# EAGLE design IMU (EAGLE 9.6.1)
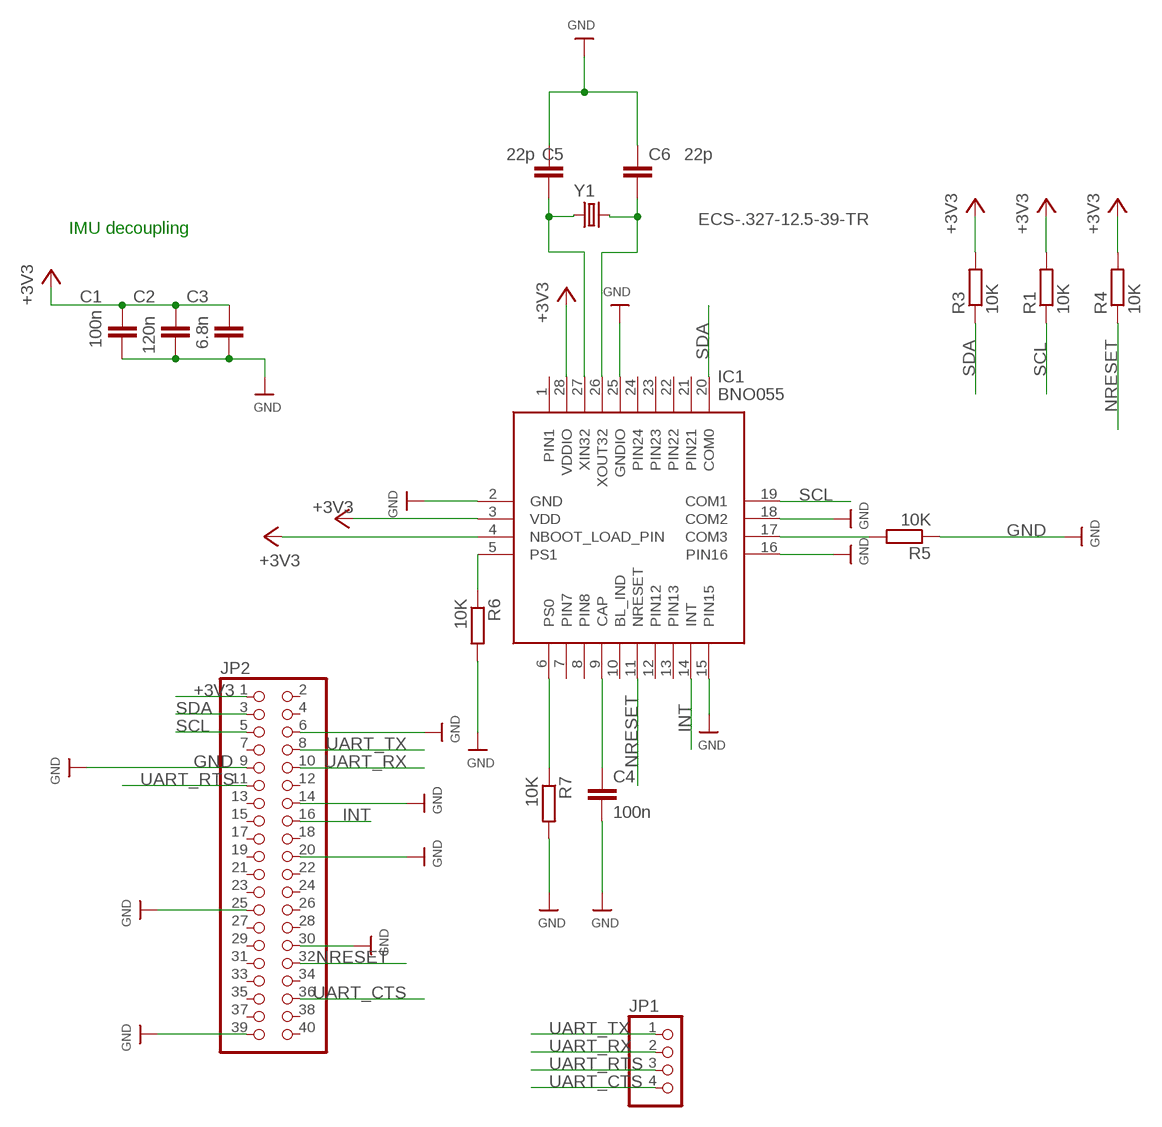
[diagram p0: schematic, sheet 1]

## Parts
C1  100n  C-EUC0805  [C0805]
C2  120n  C-EUC0805  [C0805]
C3  6.8n  C-EUC0805  [C0805]
C4  100n  C-EUC0805  [C0805]
C5  22p  C-EUC0805  [C0805]
C6  22p  C-EUC0805  [C0805]
IC1  BNO055  [BNO055]
JP1  PINHD-1X4  [1X04]
JP2  PINHD-2X20  [2X20]
R1  10K  R-EU_R0805  [R0805]
R3  10K  R-EU_R0805  [R0805]
R4  10K  R-EU_R0805  [R0805]
R5  10K  R-EU_R0805  [R0805]
R6  10K  R-EU_R0805  [R0805]
R7  10K  R-EU_R0805  [R0805]
Y1  ECS-.327-12.5-39-TR  [ECS-.327-12.5-39-TR]

## Nets
+3V3: C1.1 C2.1 C3.1 IC1.3(VDD) IC1.4(NBOOT_LOAD_PIN) IC1.28(VDDIO) JP2.1 R1.2 R3.2 R4.2
ADD_SEL: IC1.17(COM3) R5.2
CAP: C4.1 IC1.9(CAP)
GND: C1.2 C2.2 C3.2 C4.2 C5.1 C6.1 IC1.2(GND) IC1.15(PIN15) IC1.16(PIN16) IC1.18(COM2) IC1.25(GNDIO) JP2.6 JP2.9 JP2.14 JP2.20 JP2.25 JP2.30 JP2.39 R5.1 R6.2 R7.2
INT: IC1.14(INT) JP2.16
NRESET: IC1.11(NRESET) JP2.32 R4.1
PS0: IC1.6(PS0) R7.1
PS1: IC1.5(PS1) R6.1
SCL: IC1.19(COM1) JP2.5 R1.1
SDA: IC1.20(COM0) JP2.3 R3.1
UART_CTS: JP1.4 JP2.36
UART_RTS: JP1.3 JP2.11
UART_RX: JP1.2 JP2.10
UART_TX: JP1.1 JP2.8
XIN: C5.2 IC1.27(XIN32) Y1.1
XOUT: C6.2 IC1.26(XOUT32) Y1.2
Unconnected: IC1.1(PIN1) IC1.7(PIN7) IC1.8(PIN8) IC1.10(BL_IND) IC1.12(PIN12) IC1.13(PIN13) IC1.21(PIN21) IC1.22(PIN22) IC1.23(PIN23) IC1.24(PIN24) JP2.2 JP2.4 JP2.7 JP2.12 JP2.13 JP2.15 JP2.17 JP2.18 JP2.19 JP2.21 JP2.22 JP2.23 JP2.24 JP2.26 JP2.27 JP2.28 JP2.29 JP2.31 JP2.33 JP2.34 JP2.35 JP2.37 JP2.38 JP2.40

## Notes on the sheet
- IMU decoupling

## Library data of the parts
C1-C6 = rcl:C-EU: CAPACITOR, European symbol; SPICEPREFIX: C
IC1 = BNO055:BNO055: IMUs - Inertial Measurement Units Absolute Orientation 9-Axis Sensor Source: Datasheet <https://ae-bst.resource.bosch.com/media/_tech/media/datasheets/BST_BNO055_DS000_14.pdf>; DESCRIPTION: IMUs - Inertial Measurement Units Absolute Orientation 9-Axis Sensor; HEIGHT: 1mm; MANUFACTURER_NAME: Bosch Sensortec; MANUFACTURER_PART_NUMBER: BNO055; MOUSER_PART_NUMBER: 262-BNO055; MOUSER_PRICE-STOCK: https://www.mouser.co.uk/ProductDetail/Bosch-Sensortec/BNO055?qs=QhAb4EtQfbV8Z2YmISucWw%3D%3D
JP1 = pinhead:PINHD-1X4: PIN HEADER
JP2 = pinhead:PINHD-2X20: PIN HEADER
R1 R3-R7 = resistor:R-EU_: RESISTOR, European symbol
Y1 = Crystals_Oscillators:ECS-.327-12.5-39-TR: CRYSTAL 32.7680KHZ 12.5PF SMD Manufacturer's datasheet <https://ecsxtal.com/store/pdf/ECX_39.pdf>; CREATED_BY: PCBLayout.com; DIGIKEY_PART_NUMBER: XC1658TR-ND; MANUFACTURER: ECS Inc.; MPN: ECS-.327-12.5-39-TR; PACKAGE: 2-SMD

## Board
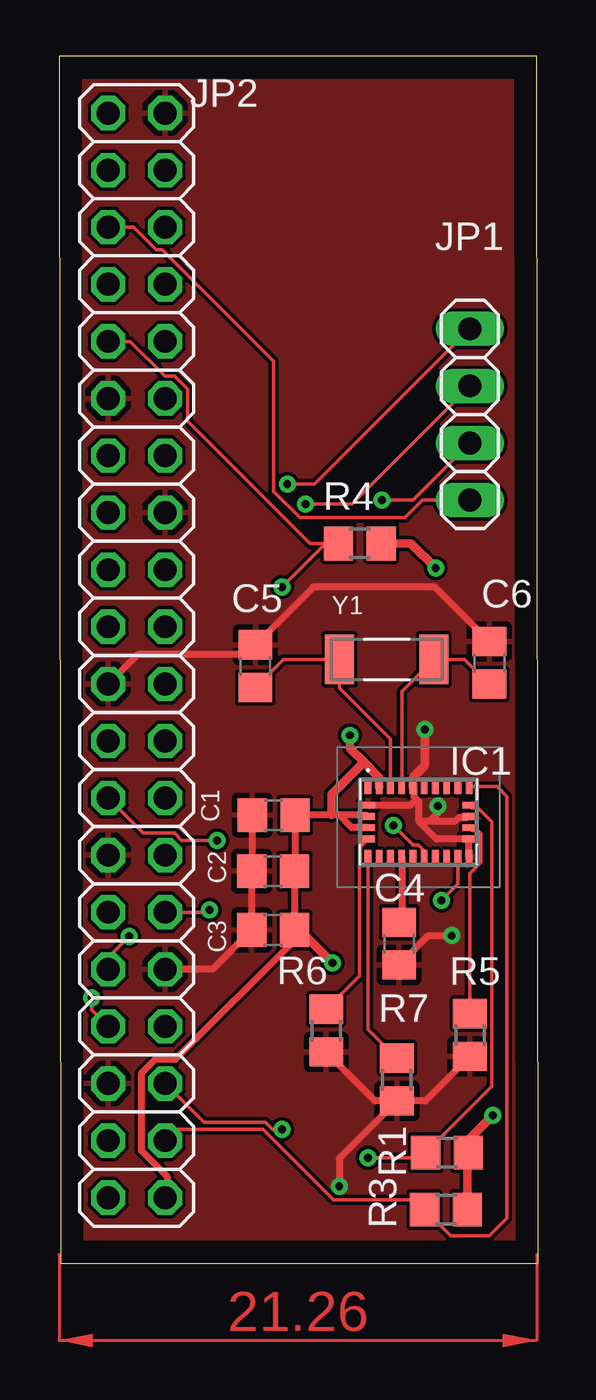
[diagram p1: board, top side]
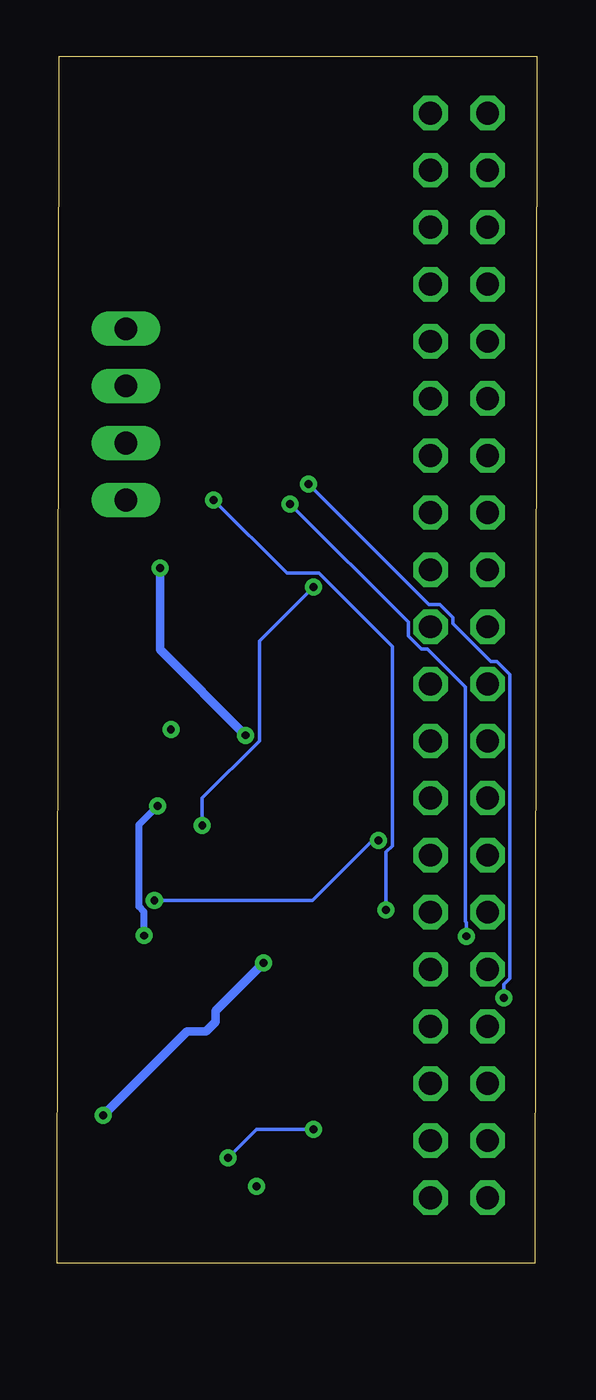
[diagram p2: board, bottom side, seen from below]

Size 21.34 x 53.71 mm. Coordinates in mm from the lower left corner, seen from the top.
Outline: 0.08,0 21.34,0 21.26,53.71 0,53.71 0.08,0
Copper layers (1*16): Top 0.035mm / dielectric 1.5mm / Bottom 0.035mm
Design rules "default": minimum track width 6mil, minimum drill 0.35mm, track to track 6mil, track to pad 6mil, pad to pad 6mil, via to via 6mil, smd to smd 6mil, copper to edge 40mil, drill to drill 6mil, minimum pad ring 10mil, minimum via ring 8mil, stop-mask expansion 4mil, vias tented up to drill 0mil, thermal gap 10mil

### Footprints (pad centres in the part's own frame; a part is rotated, then mirrored left to right if it is on the bottom)
C0805 = smd 1.3 x 1.5: 1 -0.95,0; 2 0.95,0
BNO055 = smd 0.3 x 0.6: 1 -2.25,1.55; 6 -2.25,-1.55; 7 -1.75,-1.55; 8 -1.25,-1.55; 9 -0.75,-1.55; 10 -0.25,-1.55; 11 0.25,-1.55; 12 0.75,-1.55; 13 1.25,-1.55; 14 1.75,-1.55; 15 2.25,-1.55; 20 2.25,1.55; 21 1.75,1.55; 22 1.25,1.55; 23 0.75,1.55; 24 0.25,1.55; 25 -0.25,1.55; 26 -0.75,1.55; 27 -1.25,1.55; 28 -1.75,1.55 | smd 0.6 x 0.3: 2 -2.25,0.75; 3 -2.25,0.25; 4 -2.25,-0.25; 5 -2.25,-0.75; 16 2.25,-0.75; 17 2.25,-0.25; 18 2.25,0.25; 19 2.25,0.75
1X04 = drill 1.016 long: 1 -3.81,0; 2 -1.27,0; 3 1.27,0; 4 3.81,0
2X20 = drill 1.016 octagon: 1 -24.13,-1.27; 2 -24.13,1.27; 3 -21.59,-1.27; 4 -21.59,1.27; 5 -19.05,-1.27; 6 -19.05,1.27; 7 -16.51,-1.27; 8 -16.51,1.27; 9 -13.97,-1.27; 10 -13.97,1.27; 11 -11.43,-1.27; 12 -11.43,1.27; 13 -8.89,-1.27; 14 -8.89,1.27; 15 -6.35,-1.27; 16 -6.35,1.27; 17 -3.81,-1.27; 18 -3.81,1.27; 19 -1.27,-1.27; 20 -1.27,1.27; 21 1.27,-1.27; 22 1.27,1.27; 23 3.81,-1.27; 24 3.81,1.27; 25 6.35,-1.27; 26 6.35,1.27; 27 8.89,-1.27; 28 8.89,1.27; 29 11.43,-1.27; 30 11.43,1.27; 31 13.97,-1.27; 32 13.97,1.27; 33 16.51,-1.27; 34 16.51,1.27; 35 19.05,-1.27; 36 19.05,1.27; 37 21.59,-1.27; 38 21.59,1.27; 39 24.13,-1.27; 40 24.13,1.27
R0805 = smd 1.3 x 1.5: 1 -0.95,0; 2 0.95,0
ECS-.327-12.5-39-TR = smd 1.3 x 2.2: 1 -2.1,0; 2 2.1,0

### Placement (x,y rotation side)
C1  9.55,19.94 180 top
C2  9.52,17.45 180 top
C3  9.52,14.83 180 top
C4  15.14,14.22 270 top
C5  8.74,26.57 270 top
C6  19.15,26.72 270 top
IC1  16,19.63 0 top
JP1  18.29,37.77 270 top
JP2  3.45,27.05 90 top
R1  17.27,4.93 0 top
R3  17.22,2.39 0 top
R4  13.39,32.03 0 top
R5  18.29,10.16 90 top
R6  11.89,10.36 270 top
R7  15.04,8.18 270 top
Y1  14.58,26.87 0 top

### Tracks (layer width: path | path; a pad name or v marks a point on that pad's centre or on a via)
+3V3  (via drill 0.35)
  Top 0.305: IC1.3 13.71,19.93 13.33,19.93 13.32,19.94 12.47,19.94 | 12.47,19.94 12.12,19.94 C1.1 10.5,17.48 C2.1 C3.1 10.47,14.38 5.17,9.07 4.28,9.07 3.66,8.44 3.66,5.02 4.8,3.88 4.8,3 JP2.1 | IC1.4 13.03,19.38 12.47,19.94
  Top 0.381: R3.2 18.17,4.88 R1.2 18.22,5.5 v19.3,6.58 | R4.2 15.67,32.03 v16.76,30.94 | IC1.28 14.24,21.63 13.57,22.3 | v12.95,23.49 12.95,22.92 13.57,22.3 | 13.57,22.3 12.12,20.85 12.12,19.94 | v12.17,13.36 10.69,14.83 C3.1
  Bottom 0.381: v16.76,30.94 16.76,27.3 v12.95,23.49 | v19.3,6.58 15.55,10.33 14.71,10.33 14.29,10.75 14.29,11.24 v12.17,13.36
ADD_SEL
  Top 0.152: R5.2 18.29,17.35 18.78,17.84 18.78,19.13 18.65,19.26 18.37,19.26 IC1.17
CAP
  Top 0.305: IC1.9 15.25,15.29 C4.1
GND  (via drill 0.35)
  Top 0.305: C6.1 16.72,30.1 11.32,30.1 C5.1 8.31,27.09 3.49,27.09 JP2.20 | IC1.25 15.8,21.14 15.8,20.76 15.91,20.64 | 16,19.68 16,20.55 15.91,20.64 | 16,19.68 16.51,19.68 | 16.51,19.68 17.67,19.68 17.83,19.84 18.21,19.84 | IC1.2 15.66,20.38 15.91,20.64 | C1.2 8.6,17.48 C2.2 C3.2 6.82,13.08 JP2.9 | R5.1 16.31,7.23 R7.2 | R7.2 14.07,7.23 R6.2 | R7.2 12.47,4.66 v12.47,3.43 | 16,19.68 16.8,18.88 IC1.16 IC1.15 | C4.2 16.44,14.58 v17.48,14.58 | v16.87,20.35 16.87,20.04 16.51,19.68
  Top 0.381: IC1.25 15.76,21.63 16.28,22.15 v16.28,23.75
  Bottom 0.305: v17.48,14.58 17.48,15.65 17.7,15.87 17.7,19.52 v16.87,20.35
  pour Top: 0,53.72 21.23,53.72 21.23,-0.89 0,-0.89
INT  (via drill 0.35)
  Top 0.152: IC1.14 17.75,16.89 v17.02,16.15 | v7.04,18.82 5.46,18.82 5.13,19.15 3.73,19.15 JP2.16
  Bottom 0.152: v17.02,16.15 9.98,16.15 7.31,18.82 v7.04,18.82
NRESET  (via drill 0.35)
  Top 0.152: v14.88,19.48 15.75,18.61 16,18.61 16.25,18.36 IC1.11 | v9.93,30.1 11.86,32.03 R4.1 11.17,32.03 5.71,37.48 5.71,38.89 5.13,39.47 4.71,39.47 3.16,41.02 JP2.32
  Bottom 0.152: v14.88,19.48 14.88,20.71 12.35,23.24 12.35,27.68 v9.93,30.1
PS0
  Top 0.152: IC1.6 13.75,10.41 R7.1
PS1
  Top 0.152: IC1.5 13.75,18.86 13.37,18.48 13.37,12.8 R6.1
SCL  (via drill 0.35)
  Top 0.152: JP2.5 6.45,6.27 9.2,6.27 9.5,5.97 v9.93,5.97 | v13.74,4.7 16.09,4.7 R1.1 19.27,7.87 19.27,19.64 18.64,20.27 18.37,20.27 IC1.19
  Bottom 0.152: v9.93,5.97 12.47,5.97 v13.74,4.7
SDA
  Top 0.152: JP2.3 5.23,5.97 9.07,5.97 12.22,2.82 15.84,2.82 R3.1 17.44,1.22 19.15,1.22 19.94,2.01 19.94,20.78 19.51,21.21 18.28,21.21 IC1.20
UART_CTS
  Top 0.152: JP1.4 16.18,33.96 15.39,33.17 10.72,33.17 9.55,34.34 9.55,40.13 4.58,45.11 4.31,45.11 3.32,46.1 JP2.36
UART_RTS  (via drill 0.35)
  Top 0.152: JP1.3 15.75,33.96 v14.38,33.96 | v6.71,15.72 6.6,15.62 JP2.11
  Bottom 0.152: v6.71,15.72 6.71,18.29 6.43,18.57 6.43,27.45 9.68,30.71 11.12,30.71 v14.38,33.96
UART_RX  (via drill 0.35)
  Top 0.152: JP1.2 13.03,33.78 v10.97,33.78 | v3.12,14.55 2.18,13.61 JP2.10
  Bottom 0.152: v10.97,33.78 5.71,28.52 5.71,27.91 5.13,27.33 4.87,27.33 3.17,25.63 3.17,15.21 3.12,15.16 v3.12,14.55
UART_TX  (via drill 0.35)
  Top 0.152: JP1.1 11.38,34.67 v10.16,34.67 | v1.45,11.81 1.45,11.27 JP2.8
  Bottom 0.152: v10.16,34.67 4.8,29.31 4.31,29.31 3.73,28.73 3.73,28.47 2.04,26.77 1.77,26.77 1.19,26.19 1.19,12.67 1.45,12.41 v1.45,11.81
XIN
  Top 0.152: IC1.27 14.75,23.33 12.48,25.6 Y1.1 9.99,26.87 C5.2
XOUT
  Top 0.152: IC1.26 15.25,25.45 Y1.2 18.05,26.87 C6.2
(copper drawn outside any net)
  shapes: Top area x2